# Altium schematic sheet flash.SchDoc
size A4; SheetNumber: 7; SheetTotal: 11
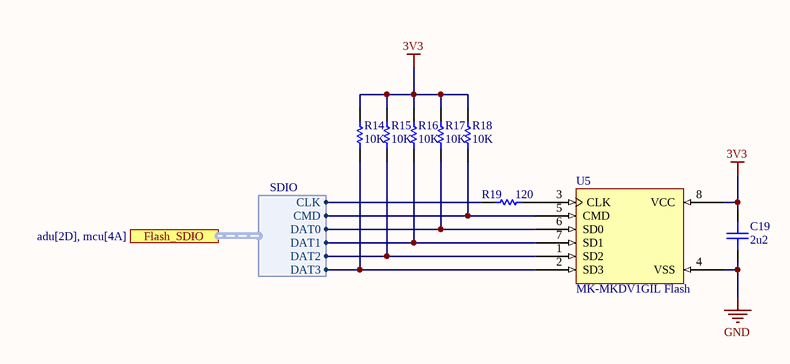
[diagram p0: flash.SchDoc]

## Parts
C19  2u2  [CAP-0603-NP]
R14  10K  [RES-0603]
R15  10K  [RES-0603]
R16  10K  [RES-0603]
R17  10K  [RES-0603]
R18  10K  [RES-0603]
R19  120  [RES-0603]
U5  MK-MKDV1GIL Flash  [QFN127P800X600X75-8N]

## Ports
Flash_SDIO (harness SDIO, see adu[2D], mcu[4A])

## Harnesses
SDIO: CLK, CMD, DAT0, DAT1, DAT2, DAT3

## Nets
3V3: C19.2 R14.2 R15.2 R16.2 R17.2 R18.2 U5.8(VCC)
GND: C19.1 U5.4(VSS)
NetR14_1: R14.1 U5.2(SD3) ; port Flash_SDIO.DAT3
NetR15_1: R15.1 U5.1(SD2) ; port Flash_SDIO.DAT2
NetR16_1: R16.1 U5.7(SD1) ; port Flash_SDIO.DAT1
NetR17_1: R17.1 U5.6(SD0) ; port Flash_SDIO.DAT0
NetR18_1: R18.1 U5.5(CMD) ; port Flash_SDIO.CMD
NetR19_1: R19.1 U5.3(CLK)
NetR19_2: R19.2 ; port Flash_SDIO.CLK

## Library data of the parts
C19 = Capacitor
R14-R19 = Resistor
U5 = MK-MKDV1GIL: 1Gbit LGA-8(6x8) SD NAND FLASH ROHS